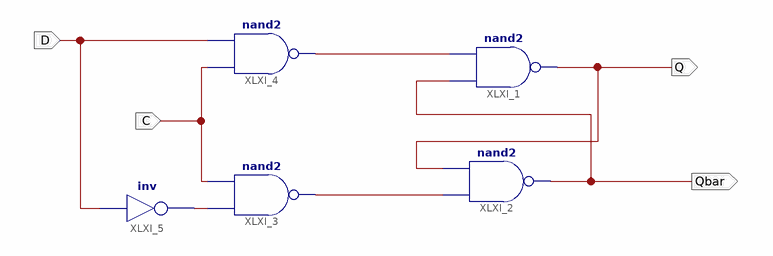
[diagram p0: schematic sheet 1]
// Xilinx ISE schematic D_LATCH.sch (kintex7) as structural Verilog: 5 symbols, 4 ports
module D_LATCH (
  input  C,
  input  D,
  output Qbar,
  output Q
);

  wire XLXN_4, XLXN_5, XLXN_11;

  nand XLXI_1 (Q, Qbar, XLXN_4);
  nand XLXI_2 (Qbar, XLXN_5, Q);
  nand XLXI_3 (XLXN_5, XLXN_11, C);
  nand XLXI_4 (XLXN_4, C, D);
  not XLXI_5 (XLXN_11, D);
endmodule
